# Altium schematic sheet Project_MachNguon.SchDoc
size A; SheetNumber: 1; SheetTotal: 1
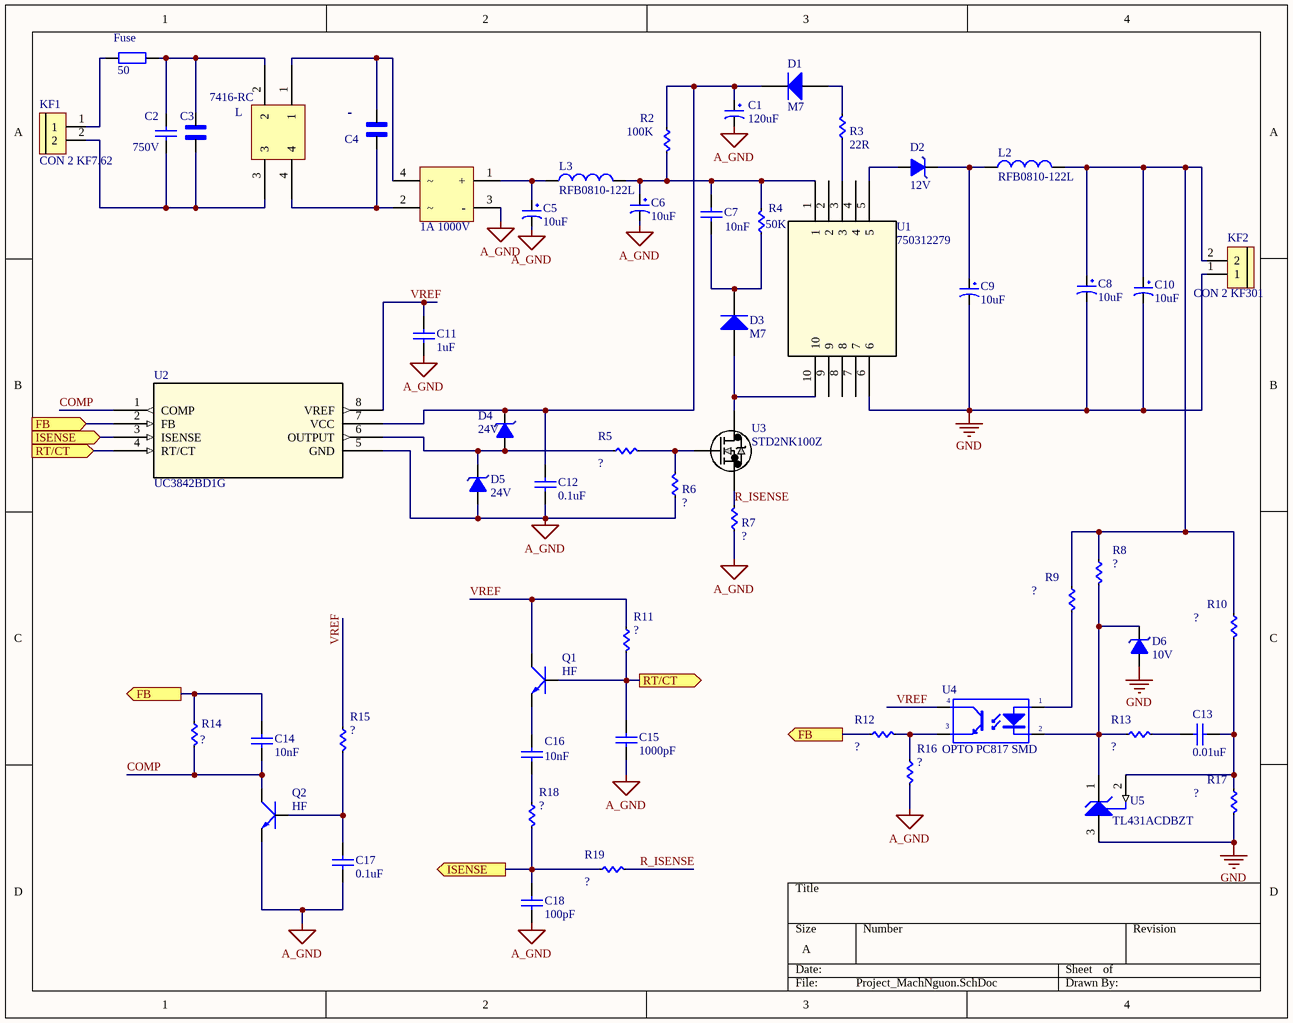
[diagram p0: Project_MachNguon.SchDoc]

## Parts
1  1A 1000V  [DIODE CAU 1A SMD SOP4]
C1  120uF  [tu hoa 5mm]
C2  750V  [tu tantalum dip5.08]
C3  B32923P3155K000  [CAPRR2250W80L2650T1450H2950]  (value not drawn)
C4  B32923P3155K000  [CAPRR2250W80L2650T1450H2950]  (value not drawn)
C5  10uF  [tu Hoa 18mm]
C6  10uF  [tu Hoa 18mm]
C7  10nF  [tu 0603]
C8  10uF  [tu hoa 10mm]
C9  10uF  [tu hoa 10mm]
C10  10uF  [tu hoa 10mm]
C11  1uF  [tu 0603]
C12  0.1uF  [tu 0603]
C13  0.01uF  [tu 0603]
C14  10nF  [tu 0603]
C15  1000pF  [tu 0603]
C16  10nF  [tu 0603]
C17  0.1uF  [tu 0603]
C18  100pF  [tu 0603]
D1  M7  [DIODE SMA]
D2  12V  [DIODE ZENNER SMD SOD80]
D3  M7  [DIODE SMA]
D4  24V  [DIODE ZENNER SMD SOD80]
D5  24V  [DIODE ZENNER SMD SOD80]
D6  10V  [DIODE ZENNER SMD SOD80]
Fuse  50  [tro vach 2w]
KF1  CON 2 KF7.62  [CON 2 KF7.62]
KF2  CON 2 KF301  [Con 2 KF301 5.08]
L  7416-RC  [7416-RC]
L2  RFB0810-122L  [IND_P220_D378_H452_70X59_TH]
L3  RFB0810-122L  [IND_P220_D378_H452_70X59_TH]
Q1  HF  [SOT-23]
Q2  HF  [SOT-23]
R2  100K  [RES 1206]
R3  22R  [RES 1206]
R4  50K  [RES 1206]
R5  ?  [RES 0603]
R6  ?  [RES 0603]
R7  ?  [RES 0603]
R8  ?  [RES 0603]
R9  ?  [RES 0603]
R10  ?  [RES 0603]
R11  ?  [RES 0603]
R12  ?  [RES 0603]
R13  ?  [RES 0603]
R14  ?  [RES 0603]
R15  ?  [RES 0603]
R16  ?  [RES 0603]
R17  ?  [RES 0603]
R18  ?  [RES 0603]
R19  ?  [RES 0603]
U1  750312279  [750312279_WRE]
U2  UC3842BD1G  [SOIC8_ONS-L]
U3  STD2NK100Z  [DPAK_STM-L]
U4  OPTO PC817 SMD  [SOP4]
U5  TL431ACDBZT  [SOT 23-3]

## Ports
FB (in, see Project_MachNguon[1C], Project_MachNguon[3C]), FB (out, see Project_MachNguon[1B], Project_MachNguon[1C]), FB (out, see Project_MachNguon[1B], Project_MachNguon[3C]), ISENSE (in, see Project_MachNguon[2D]), ISENSE (out, see Project_MachNguon[1B]), RT/CT (in, see Project_MachNguon[2C]), RT/CT (out, see Project_MachNguon[1B])

## Nets
A_GND: 1.3(-) C1.2 C5.2 C6.2 C11.2 C12.2 C15.1 C17.1 C18.2 D5.1(A) Q2.2(E) R6.1 R7.1 R16.2 U2.5(GND)
GND: C8.2 C9.2 C10.2 D6.1(A) KF2.1 R17.2 U1.6 U5.3(ANODE)
COMP: C14.1 Q2.3(C) R14.2 U2.1(COMP)
FB: C14.2 R12.1 R14.1 U2.2(FB) ; port FB
ISENSE: C18.1 R18.2 R19.1 U2.3(ISENSE) ; port ISENSE
R_ISENSE: R7.2 R19.2 U3.2
RT/CT: C15.2 Q1.1(B) R11.2 U2.4(RT/CT) ; port RT/CT
VREF: C11.1 Q1.3(C) R11.1 R15.1 U2.8(VREF) U4.4(C)
Net1_1: 1.1(+) C5.1 L3.1
Net1_2: 1.2 C4.1 L.4
Net1_4: 1.4 C4.2 L.1
NetC1_1: C1.1 C12.1 D1.2(K) D4.2(K) R2.1 U2.7(VCC)
NetC2_1: C2.1 C3.2 Fuse.2 L.2
NetC2_2: C2.2 C3.1 KF1.2 L.3
NetC6_1: C6.1 C7.1 L3.2 R2.2 R4.2 U1.1
NetC7_2: C7.2 D3.2(K) R4.1
NetC8_1: C8.1 C10.1 KF2.2 L2.2 R8.1 R9.1 R10.1
NetC9_1: C9.1 D2.2(K) L2.1
NetC13_1: C13.1 R10.2 R17.1 U5.2(REF)
NetC13_2: C13.2 R13.2
NetC16_1: C16.1 R18.1
NetC16_2: C16.2 Q1.2(E)
NetC17_2: C17.2 Q2.1(B) R15.2
NetD1_1: D1.1(A) R3.2
NetD2_1: D2.1(A) U1.5
NetD3_1: D3.1(A) U1.10 U3.3
NetD4_1: D4.1(A) D5.2(K) R5.1 U2.6(OUTPUT)
NetD6_2: D6.2(K) R8.2 R13.1 U4.2(K) U5.1(CATHODE)
NetFuse_1: Fuse.1 KF1.1
NetR3_1: R3.1 U1.3
NetR5_2: R5.2 R6.2 U3.1
NetR9_2: R9.2 U4.1(A)
NetR12_2: R12.2 R16.1 U4.3(E)

Not connected (* = marked no-connect by the designer): U1 2 4 7 8 9

## Library data of the parts
1 = Diode CAU 1A SMD: Dán; Ten_Linh_Kien: DBS10 SOP4 Diode Cầu 1A 1000V; Don_Vi: Con; Ma_Hang: MH009806; Ghi_Chu: *; Kieu_Chan: *; Chung_Loai: Dán
C1 = Tu Hoa 100uF 25V 6x11: Cắm; Don_Vi: Con; So_Chan: 2; Ten_Linh_Kien: Tụ Hóa 100uF 25V 6x11MM; Ma_Hang: MH001351; Chung_Loai: Cắm; Kieu_Chan: *
C2 = Tu tantalum 100pF DIP5.08: Cắm; Don_Vi: Con; So_Chan: 2; Ten_Linh_Kien: Tụ tantalum 101-100pF DIP5.08 (sứ vàng); Ma_Hang: MH006964; Chung_Loai: Cắm; Kieu_Chan: *
C3 C4 = B32923P3155K000: SUPPRESSION CAP, 1.5UF, CLASS X2, 305VAC ROHS COMPLIANT: YES; MF: TDK Electronics; SnapEDA_Link: https://www.snapeda.com/parts/B32923P3155K000/TDK/view-part/?ref=snap; Package: NON-STANDARD-2 TDK; Value: *; MP: B32923P3155K000; Check_prices: https://www.snapeda.com/parts/B32923P3155K000/TDK/view-part/?ref=eda
C5 C6 = Tu Hoa 100uF 450V 18x35: Cắm; Don_Vi: Con; So_Chan: 2; Ten_Linh_Kien: Tụ Hóa 100uF 450V 18x35MM; Ma_Hang: MH003953; Chung_Loai: Cắm; Kieu_Chan: *
C7 = Tu 0603 105 50V 10%: Dán; Don_Vi: Con; So_Chan: 2; Ten_Linh_Kien: Tụ 0603 105-1uF 50V 10%; Ma_Hang: MH004569; Chung_Loai: Dán; Kieu_Chan: *
C8-C10 = Tu Hoa 1000uF 10V 10x12: Cắm; So_Chan: 2; Don_Vi: Con; Ten_Linh_Kien: Tụ Hóa 1000uF 10V 10x12MM; Ma_Hang: MH006614; Kieu_Chan: *; Chung_Loai: Cắm
C11-C18 = Tu 0603 101 50V 10%: Dán; Don_Vi: Con; So_Chan: 2; Ten_Linh_Kien: Tụ 0603 101-0.1nF 10% 50V; Ma_Hang: MH004565; Chung_Loai: Dán; Kieu_Chan: *
D1 D3 = Diode M7 ( 4007 ): Dán; Don_Vi: Con; Ten_Linh_Kien: Diode M7 1N4007 SMD 1A 1000V; Ma_Hang: MH000944; Chung_Loai: Dán; Ghi_Chu: *
D2 D6 = Diode Zener 12V: Dán; Ma_Hang: MH000945; Don_Vi: Con; Ten_Linh_Kien: Diode Zener 1/2W 12V SMD1206 ZMM12; Kieu_Chan: *; Ghi_Chu: *; Chung_Loai: Dán
D4 D5 = Diode Zener 24V: Cắm; Don_Vi: Con; Ten_Linh_Kien: Diode Zener 1/2W 24V DIP 1N5252B; Ma_Hang: MH002878; Ghi_Chu: *; Kieu_Chan: *; Chung_Loai: Cắm
Fuse = Tro Vach 2W 5% 100R: Cắm; Don_Vi: Con; So_Chan: 2; Ten_Linh_Kien: Trở 5% 2w 100R; Ma_Hang: MH006357; Chung_Loai: Cắm; Kieu_Chan: *
KF1 = CON 2 KF7.62: Cắm; Ma_Hang: MH002053; Ten_Linh_Kien: CON 2 KF7.62-2P 7.62MM (Đen Thẳng); Chung_Loai: Cắm; Ghi_Chu: *; Kieu_Chan: *; Don_Vi: Con
KF2 = CON 2 KF301: Cắm; Ma_Hang: MH000987; Ten_Linh_Kien: CON 2 KF301-2P 5.08MM Xanh Dương; Chung_Loai: Cắm; Ghi_Chu: *; Kieu_Chan: *; Don_Vi: Con
L2 L3 = IND_1.2mH-0.47A-10%-TH: Fixed Inductors RFB0810 AEC-Q200 100kHz 2.8mOhms; Manufacturer: Coilcraft; Alternate Part Number-1: NA; Manufacturer Part Number: RFB0810-122L; Case/Package: TH; Supplier-1: COILCRAFT SAMPLE; Supplier Part Number-1: RFB0810-122L
Q1 Q2 = Trans C1815 HF SMD: SOT-23; Value: C9014
R2-R4 = RES 1206: RES SMD 1206; Manufacturer: Vishay Dale; Manufacturer Part Number: CRCW040210K0FKED; Resistance (Ohms): 10k; Tolerance: ±1%; Power (Watts): 0.063W, 1/16W; Temperature Coefficient: ±100ppm/°C; Supplier 1: Digi-Key; RoHS: RoHS Compliant; Category: Resistors; Stock 1: 2392462; Pricing 1: 10=0.083, 50=0.0444, 200=0.0255, 1000=0.0174 (USD); Packaging: Cut Tape (CT); Composition: Thick Film; Features: Automotive AEC-Q200; Operating Temperature: -55°C ~ 155°C; Package / Case: 0402 (1005 Metric); Supplier Device Package: 0402 (1005 Metric); Size / Dimension: 0.039" L x 0.020" W (1.00mm x 0.50mm); Height: 0.016" (0.40mm); Number of Terminations: 2; ComponentLink1URL: http://www.vishay.com/docs/20035/dcrcwe3.pdf; ComponentLink1Description: http://www.vishay.com/docs/20035/dcrcwe3.pdf; Supplier Part Number 1: 541-10.0KLCT-ND
R5-R19 = RES 0603: RES SMD 0603; Manufacturer: Vishay Dale; Manufacturer Part Number: CRCW040210K0FKED; Resistance (Ohms): 10k; Tolerance: ±1%; Power (Watts): 0.063W, 1/16W; Temperature Coefficient: ±100ppm/°C; Supplier 1: Digi-Key; RoHS: RoHS Compliant; Category: Resistors; Stock 1: 2392462; Pricing 1: 10=0.083, 50=0.0444, 200=0.0255, 1000=0.0174 (USD); Packaging: Cut Tape (CT); Composition: Thick Film; Features: Automotive AEC-Q200; Operating Temperature: -55°C ~ 155°C; Package / Case: 0402 (1005 Metric); Supplier Device Package: 0402 (1005 Metric); Size / Dimension: 0.039" L x 0.020" W (1.00mm x 0.50mm); Height: 0.016" (0.40mm); Number of Terminations: 2; ComponentLink1URL: http://www.vishay.com/docs/20035/dcrcwe3.pdf; ComponentLink1Description: http://www.vishay.com/docs/20035/dcrcwe3.pdf; Supplier Part Number 1: 541-10.0KLCT-ND
U1 = 750312279: Description; Manufacturer_Name: Wurth Electronics; Copyright: Copyright (C) 2025 Ultra Librarian. All rights reserved.; Manufacturer_Part_Number: 750312279; RefDes: RefDes; Type: Type
U2 = UC3842BD1G: No Description Available; Manufacturer_Name: onsemi; Copyright: Copyright (C) 2025 Ultra Librarian. All rights reserved.; Manufacturer_Part_Number: UC3842BD1G; RefDes: RefDes; Type: Type
U3 = STD2NK100Z: N-channel 1000 V, 6.25 Ohm typ., 1.85 A SuperMESH Power MOSFET in a DPAK package; Manufacturer_Name: STMicroelectronics; Copyright: Copyright (C) 2025 Ultra Librarian. All rights reserved.; Manufacturer_Part_Number: STD2NK100Z
U4 = OPTO PC817 SMD: Single Opto; Value: PC817
U5 = IC_TL431ACDBZT: Shunt Voltage Reference IC 36V ±1% SOT-23-3; Manufacturer: Texas Instruments; Alternate Part Number-1: NA; Manufacturer Part Number: TL431ACDBZT; Case/Package: SOT-23; Supplier-1: Mouser; Supplier Part Number-1: 595-TL431ACDBZT